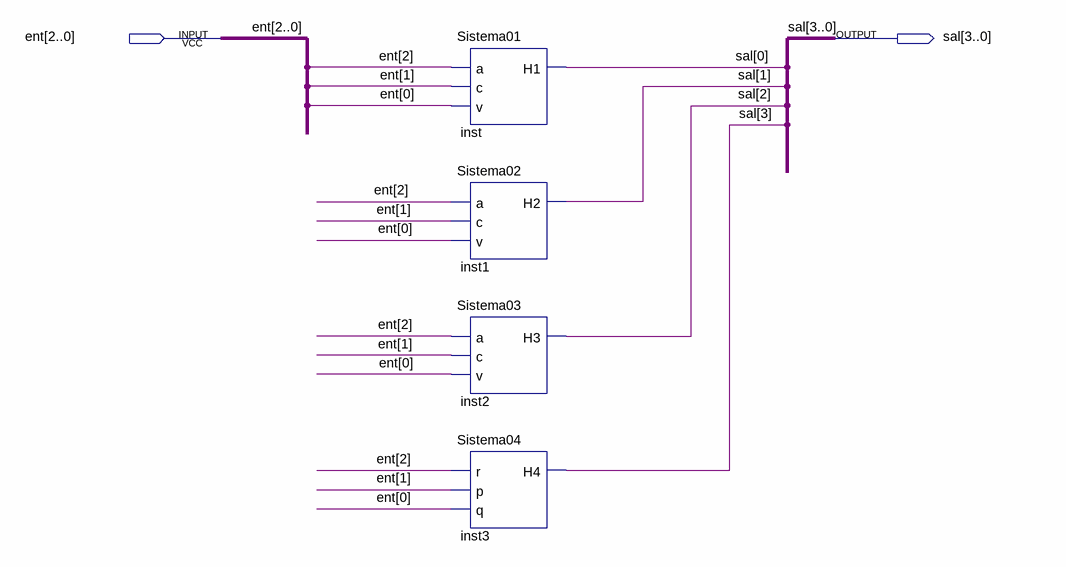
[diagram p0: schematic sheet]
// Quartus schematic Sistema_Final.bdf as structural Verilog: 4 symbols, 2 pins
module Sistema_Final (
  input  [2:0] ent,
  output [3:0] sal
);

  Sistema01 inst (.a(ent[2]), .c(ent[1]), .v(ent[0]), .H1(sal[0]));
  Sistema02 inst1 (.a(ent[2]), .c(ent[1]), .v(ent[0]), .H2(sal[1]));
  Sistema03 inst2 (.a(ent[2]), .c(ent[1]), .v(ent[0]), .H3(sal[2]));
  Sistema04 inst3 (.r(ent[2]), .p(ent[1]), .q(ent[0]), .H4(sal[3]));
endmodule
